# Altium schematic sheet MCED_Controller.SchDoc
size A4; SheetNumber: 1; SheetTotal: 2
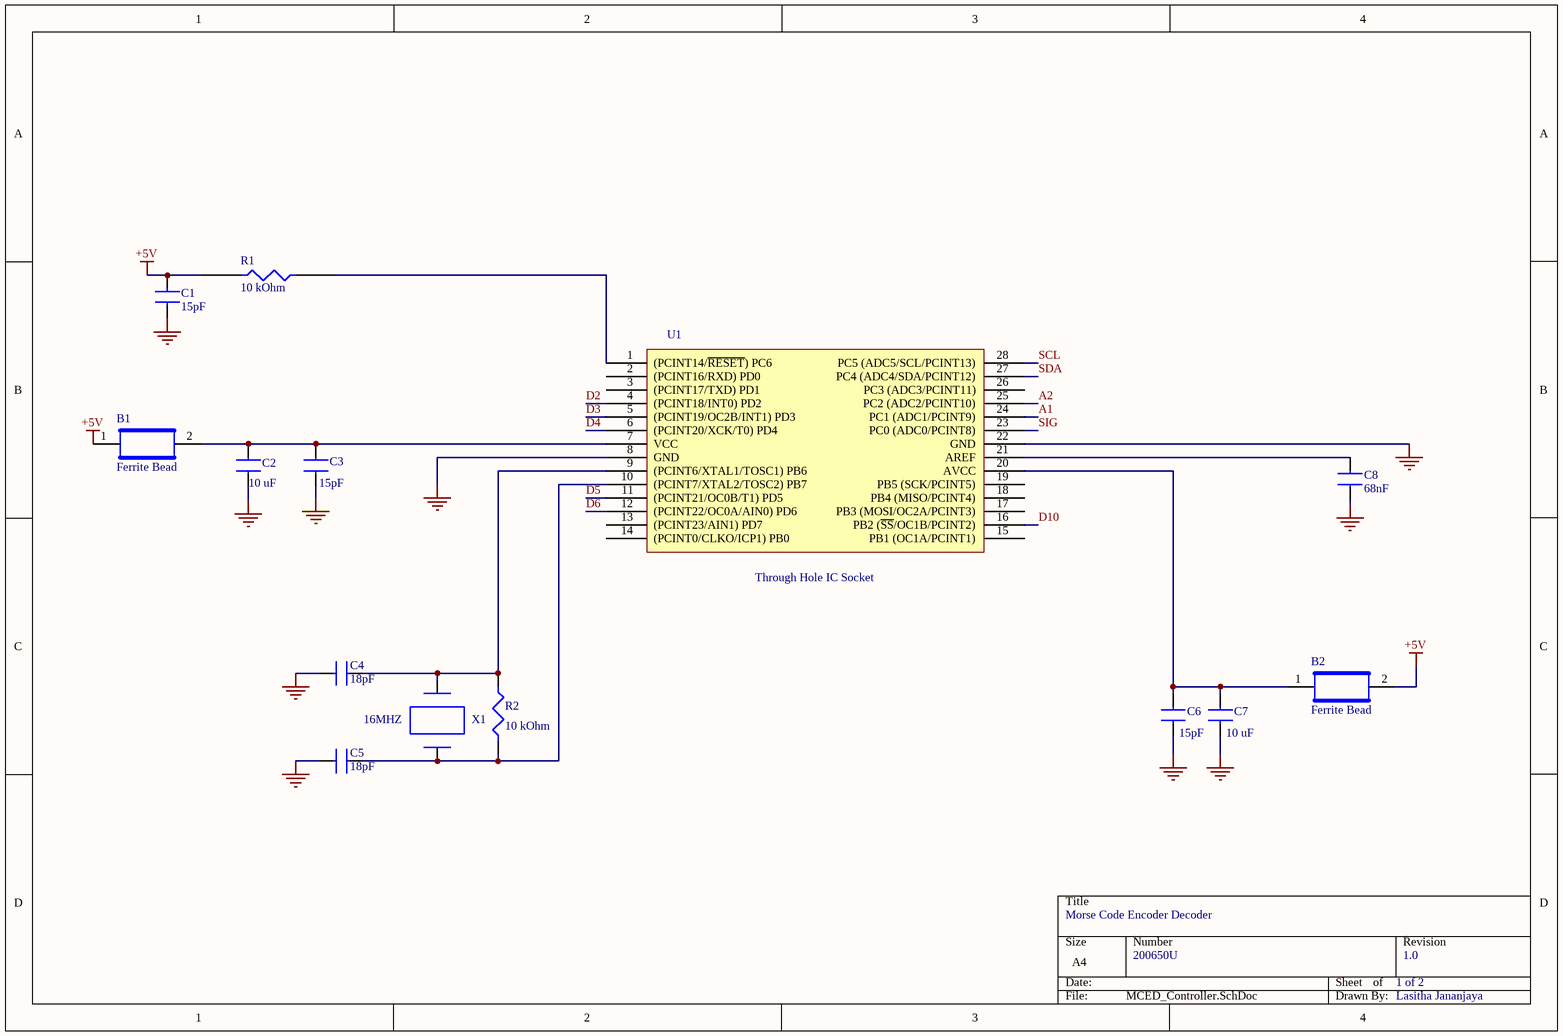
[diagram p0: MCED_Controller.SchDoc]

## Parts
B1  Ferrite Bead  [FERRITE BEAD C2012X105N]
B2  Ferrite Bead  [FERRITE BEAD C2012X105N]
C1  15pF  [C0805]
C2  10 uF  [C0805]
C3  15pF  [C0805]
C4  18pF  [C0805]
C5  18pF  [C0805]
C6  15pF  [C0805]
C7  10 uF  [C0805]
C8  68nF  [C0805]
R1  10 kOhm  [10K]
R2  10 kOhm  [10K]
U1  Through Hole IC Socket  [28dip_through_hole_ic_socket]
X1  16MHZ  [ABLS-16.000MHZ-B4-T_CRYSTAL]

## Nets
+5V: B1.1 B2.2 C1.2 R1.2
GND: C1.1 C2.1 C3.1 C4.2 C5.2 C6.1 C7.1 C8.1 U1.8(GND) U1.22(GND)
A1: U1.24(PC1_(ADC1/PCINT9))
A2: U1.25(PC2_(ADC2/PCINT10))
D2: U1.4((PCINT18/INT0)_PD2)
D3: U1.5((PCINT19/OC2B/INT1)_PD3)
D4: U1.6((PCINT20/XCK/T0)_PD4)
D5: U1.11((PCINT21/OC0B/T1)_PD5)
D6: U1.12((PCINT22/OC0A/AIN0)_PD6)
D10: U1.16(PB2_(~{SS}/OC1B/PCINT2))
SCL: U1.28(PC5_(ADC5/SCL/PCINT13))
SDA: U1.27(PC4_(ADC4/SDA/PCINT12))
SIG: U1.23(PC0_(ADC0/PCINT8))
NetB1_2: B1.2 C2.2 C3.2 U1.7(VCC)
NetB2_1: B2.1 C6.2 C7.2 U1.20(AVCC)
NetC4_1: C4.1 R2.2 U1.9((PCINT6/XTAL1/TOSC1)_PB6) X1.2
NetC5_1: C5.1 R2.1 U1.10((PCINT7/XTAL2/TOSC2)_PB7) X1.1
NetC8_2: C8.2 U1.21(AREF)
NetR1_1: R1.1 U1.1((PCINT14/~{RESET})_PC6)

Not connected (* = marked no-connect by the designer): U1 2((PCINT16/RXD)_PD0) 3((PCINT17/TXD)_PD1) 13((PCINT23/AIN1)_PD7) 14((PCINT0/CLKO/ICP1)_PB0) 15(PB1_(OC1A/PCINT1)) 17(PB3_(MOSI/OC2A/PCINT3)) 18(PB4_(MISO/PCINT4)) 19(PB5_(SCK/PCINT5)) 26(PC3_(ADC3/PCINT11))

## Notes on the sheet
- Morse Code Encoder Decoder
- 200650U
- 1 of 2
- 1.0
- Lasitha Jananjaya

## Library data of the parts
B1 B2 = MPZ2012S601AT000: Ferrite Bead, 1 Function(s), 2A; Manufacturer: TDK; DC Resistance-Max: 100mR; Filter Type: FERRITE CHIP; Clock Frequency: 100MHz; Channels: 1; Output Impedance: 600R; Supplier: Mouser; Supplier Part Number: 810-MPZ2012S601AT000; Manufacturer Part Number: MPZ2012S601AT000; RoHS: Yes; Category: Ferrite Beads and Chips; Stock: 782263; Pricing: 1=0.12, 10=0.061, 50=0.061, 100=0.042, 1000=0.035, 10000=0.027 (USD); Mounting Technology: Surface Mount; Material: Ferrite; Case Code: 0805; Terminal Finish: Copper; Min Operating Temperature: -55°C; Max Operating Temperature: 125°C; JESD-609 Code: e2; Construction: Chip Bead; Min Frequency: 100MHz; Packaging: Tape and Reel; Current Rating: 2A; Length: 2mm; Width: 1.25mm; Height: 0.85mm; Reach SVHC Compliant: Yes; RoHS Compliant: Yes; ComponentLink1URL: https://datasheet.ciiva.com:443/pdfs/VipMasterIC/IC/TDKC/TDKC-S-A0008032886/TDKC-S-A0008032886-1.pdf?src-supplier=IHS+Markit; ComponentLink1Description: https://datasheet.ciiva.com:443/pdfs/VipMasterIC/IC/TDKC/TDKC-S-A0008032886/TDKC-S-A0008032886-1.pdf?src-supplier=IHS+Markit; ComponentLink2URL: https://datasheet.ciiva.com/46634/beads-commercial-power-mpz-en-46634335.pdf?src-supplier=Digi-Key; ComponentLink2Description: https://datasheet.ciiva.com/46634/beads-commercial-power-mpz-en-46634335.pdf?src-supplier=Digi-Key; ComponentLink3URL: https://datasheet.ciiva.com/46634/beads-commercial-power-mpz-en-46634377.pdf?src-supplier=Digi-Key; ComponentLink3Description: https://datasheet.ciiva.com/46634/beads-commercial-power-mpz-en-46634377.pdf?src-supplier=Digi-Key; ComponentLink4URL: https://datasheet.ciiva.com/46634/beads-commercial-power-mpz-en-46634606.pdf?src-supplier=Digi-Key; ComponentLink4Description: https://datasheet.ciiva.com/46634/beads-commercial-power-mpz-en-46634606.pdf?src-supplier=Digi-Key
C1 C3-C6 = VJ0805A220GXACW1BC: 22pF Ceramic Capacitor, Multilayer, Ceramic, 50V, 2% +Tol, 2% -Tol, C0G, -/+30ppm/Cel TC, 0.000022uF, Surface Mount, 0805; Manufacturer: Vishay Vitramon; Manufacturer Series: VJ; Multilayer: Yes; Supplier: LCSC; Supplier Part Number: C2174318; Manufacturer Part Number: VJ0805A220GXACW1BC; RoHS: Yes; Category: Ceramic Capacitors; Stock: 3750; Pricing: 5=0.0755, 50=0.0623, 150=0.0557, 500=0.0508, 2500=0.042, 4000=0.04 (USD); Mounting Technology: Surface Mount; Pins: 2; Dielectric Material: Ceramic; Package Shape: Rectangular; Case/Package: 0805; Terminal Finish: Tin; Min Operating Temperature: -55°C; Max Operating Temperature: 125°C; JESD-609 Code: e3; Value: 22pF; Capacitor Type: Ceramic; Tolerance  (fill in as +-): 2%; Packaging: Tape and Reel; Tolerance (fill in as +-): 2%; Rated DC Voltage (URdc): 50V; Temperature Characteristics Code: C0G; Termination: Wraparound; Reach SVHC Compliant: Yes; RoHS Compliant: Yes; ComponentLink1URL: https://datasheet.ciiva.com:443/pdfs/VipMasterIC/IC/BEYS/BEYSS01615/BEYSS01615-1.pdf?src-supplier=IHS+Markit; ComponentLink1Description: https://datasheet.ciiva.com:443/pdfs/VipMasterIC/IC/BEYS/BEYSS01615/BEYSS01615-1.pdf?src-supplier=IHS+Markit; ComponentLink2URL: https://datasheet.ciiva.com/16511/vjw1bcbascomseries-16511287.pdf?src-supplier=Future+Electronics; ComponentLink2Description: https://datasheet.ciiva.com/16511/vjw1bcbascomseries-16511287.pdf?src-supplier=Future+Electronics
C2 C7 C8 = CL21A106KBYQNNE: 10 uF Ceramic Capacitor, Multilayer, Ceramic, 50V, 10% +Tol, 10% -Tol, X5R, 15% TC, 10uF, Surface Mount, 0805; Manufacturer: Samsung; Supplier: Mouser; Supplier Part Number: 187-CL21A106KBYQNNE; Manufacturer Part Number: CL21A106KBYQNNE; RoHS: Yes; Category: Ceramic Capacitors; Stock: 29602; Pricing: 1=0.42, 10=0.299, 50=0.299, 100=0.197, 1000=0.124, 10000=0.1 (USD); Pins: 2; Dielectric Material: Ceramic; Capacitor Type: Ceramic; Reach SVHC Compliant: Yes; RoHS Compliant: Yes; ComponentLink1URL: https://datasheet.ciiva.com:443/pdfs/VipMasterIC/IC/SEMS/SEMS-S-A0008524728/SEMS-S-A0008519922-1.pdf?src-supplier=IHS+Markit; ComponentLink1Description: https://datasheet.ciiva.com:443/pdfs/VipMasterIC/IC/SEMS/SEMS-S-A0008524728/SEMS-S-A0008519922-1.pdf?src-supplier=IHS+Markit
R1 R2 = MCU0805MD1002DP500: 10 kOhm, Fixed Resistor, Thin Film, 0.2W, 10000ohm, 150V, 0.5% +/-Tol, -25,25ppm/Cel, 0805; Manufacturer: Vishay Beyschlag; Power: 200mW; Value: 10kR; Temperature Coefficient: -2525ppm/°C; Package Height: 0.52mm; Package Length: 2mm; Package Width: 1.25mm; Reference Standard: AEC-Q200; Supplier: Mouser; Supplier Part Number: 594-MCU0805MD1002DP5; Manufacturer Part Number: MCU0805MD1002DP500; RoHS: Yes; Category: Chip SMD Resistors; Stock: 49020; Pricing: 1=0.39, 10=0.3, 50=0.3, 100=0.127, 1000=0.07, 10000=0.06 (USD); Pins: 2; Case/Package: 0805; Terminal Finish: Nickel; Min Operating Temperature: -55°C; Max Operating Temperature: 175°C; Tolerance: 0.5%; JESD-609 Code: e3; Resistor Type: FIXED RESISTOR; Construction: Chip; Package Style: SMTMeter; Packaging: Tape and Reel; Series: MCU 0805 AT-PROF; Technology: THIN FILM; Working Voltage: 150V; Reach SVHC Compliant: Yes; RoHS Compliant: Yes; ComponentLink1URL: https://datasheet.ciiva.com:443/pdfs/VipMasterIC/IC/VISH/VISH-S-A0002932058/VISH-S-A0002932058-1.pdf?src-supplier=IHS+Markit; ComponentLink1Description: https://datasheet.ciiva.com:443/pdfs/VipMasterIC/IC/VISH/VISH-S-A0002932058/VISH-S-A0002932058-1.pdf?src-supplier=IHS+Markit; ComponentLink2URL: https://datasheet.ciiva.com/12696/mcat-pro-223602-12696124.pdf?src-supplier=Mouser; ComponentLink2Description: https://datasheet.ciiva.com/12696/mcat-pro-223602-12696124.pdf?src-supplier=Mouser
U1 = ICS-328-T: Through Hole IC Sockets 28P / .300"; Manufacturer: Adam Equipment; Supplier: Arrow Electronics; Supplier Part Number: ICS-328-T; Manufacturer Part Number: ICS-328-T; RoHS: Yes; Category: IC and Component Sockets; Stock: 603; Pricing: 1=0.1941, 17=0.1922, 34=0.1565, 51=0.1549, 85=0.1534, 238=0.139, 442=0.1333, 952=0.1182 (USD); ComponentLink1URL: https://datasheet.ciiva.com/16210/page-187-188-16210500.pdf?src-supplier=Future+Electronics; ComponentLink1Description: https://datasheet.ciiva.com/16210/page-187-188-16210500.pdf?src-supplier=Future+Electronics
X1 = ABLS-16.000MHZ-B4-T: 16MHz ±30ppm 晶体 18pF 40 欧姆 -20°C ~ 70°C  表面贴装 HC49/US; Manufacturer: Abracon; Supplier: LCSC; Supplier Part Number: C596821; Manufacturer Part Number: ABLS-16.000MHZ-B4-T; RoHS: Yes; Category: Crystals; Stock: 196; Pricing: 1=0.2737, 10=0.1984, 30=0.1552, 100=0.136, 500=0.1275, 1000=0.1224 (USD); ComponentLink1URL: https://datasheet.ciiva.com/15116/getdatasheetpartid-719935-15116811.pdf?src-supplier=Verical; ComponentLink1Description: https://datasheet.ciiva.com/15116/getdatasheetpartid-719935-15116811.pdf?src-supplier=Verical; ComponentLink2URL: https://datasheet.ciiva.com/854/abls-854145.pdf?src-supplier=Digi-Key; ComponentLink2Description: https://datasheet.ciiva.com/854/abls-854145.pdf?src-supplier=Digi-Key; ComponentLink3URL: https://datasheet.ciiva.com/854/abls-854144.pdf?src-supplier=Digi-Key; ComponentLink3Description: https://datasheet.ciiva.com/854/abls-854144.pdf?src-supplier=Digi-Key; ComponentLink4URL: https://datasheet.ciiva.com/854/abls-854146.pdf?src-supplier=Digi-Key; ComponentLink4Description: https://datasheet.ciiva.com/854/abls-854146.pdf?src-supplier=Digi-Key; ComponentLink5URL: https://datasheet.ciiva.com/3175/abls-3175359.pdf?src-supplier=Avnet; ComponentLink5Description: https://datasheet.ciiva.com/3175/abls-3175359.pdf?src-supplier=Avnet; ComponentLink6URL: https://datasheet.ciiva.com/16423/abls-16423759.pdf?src-supplier=Future+Electronics; ComponentLink6Description: https://datasheet.ciiva.com/16423/abls-16423759.pdf?src-supplier=Future+Electronics